# EAGLE design Arduino-Media-Player (EAGLE 6.3)
CNAME: Arduino Media Player; CREVISION: A; DESIGNER: Drawn By: BJE

## Sheet 1 of 3: MIcrocontroller, USB interface, and RTC
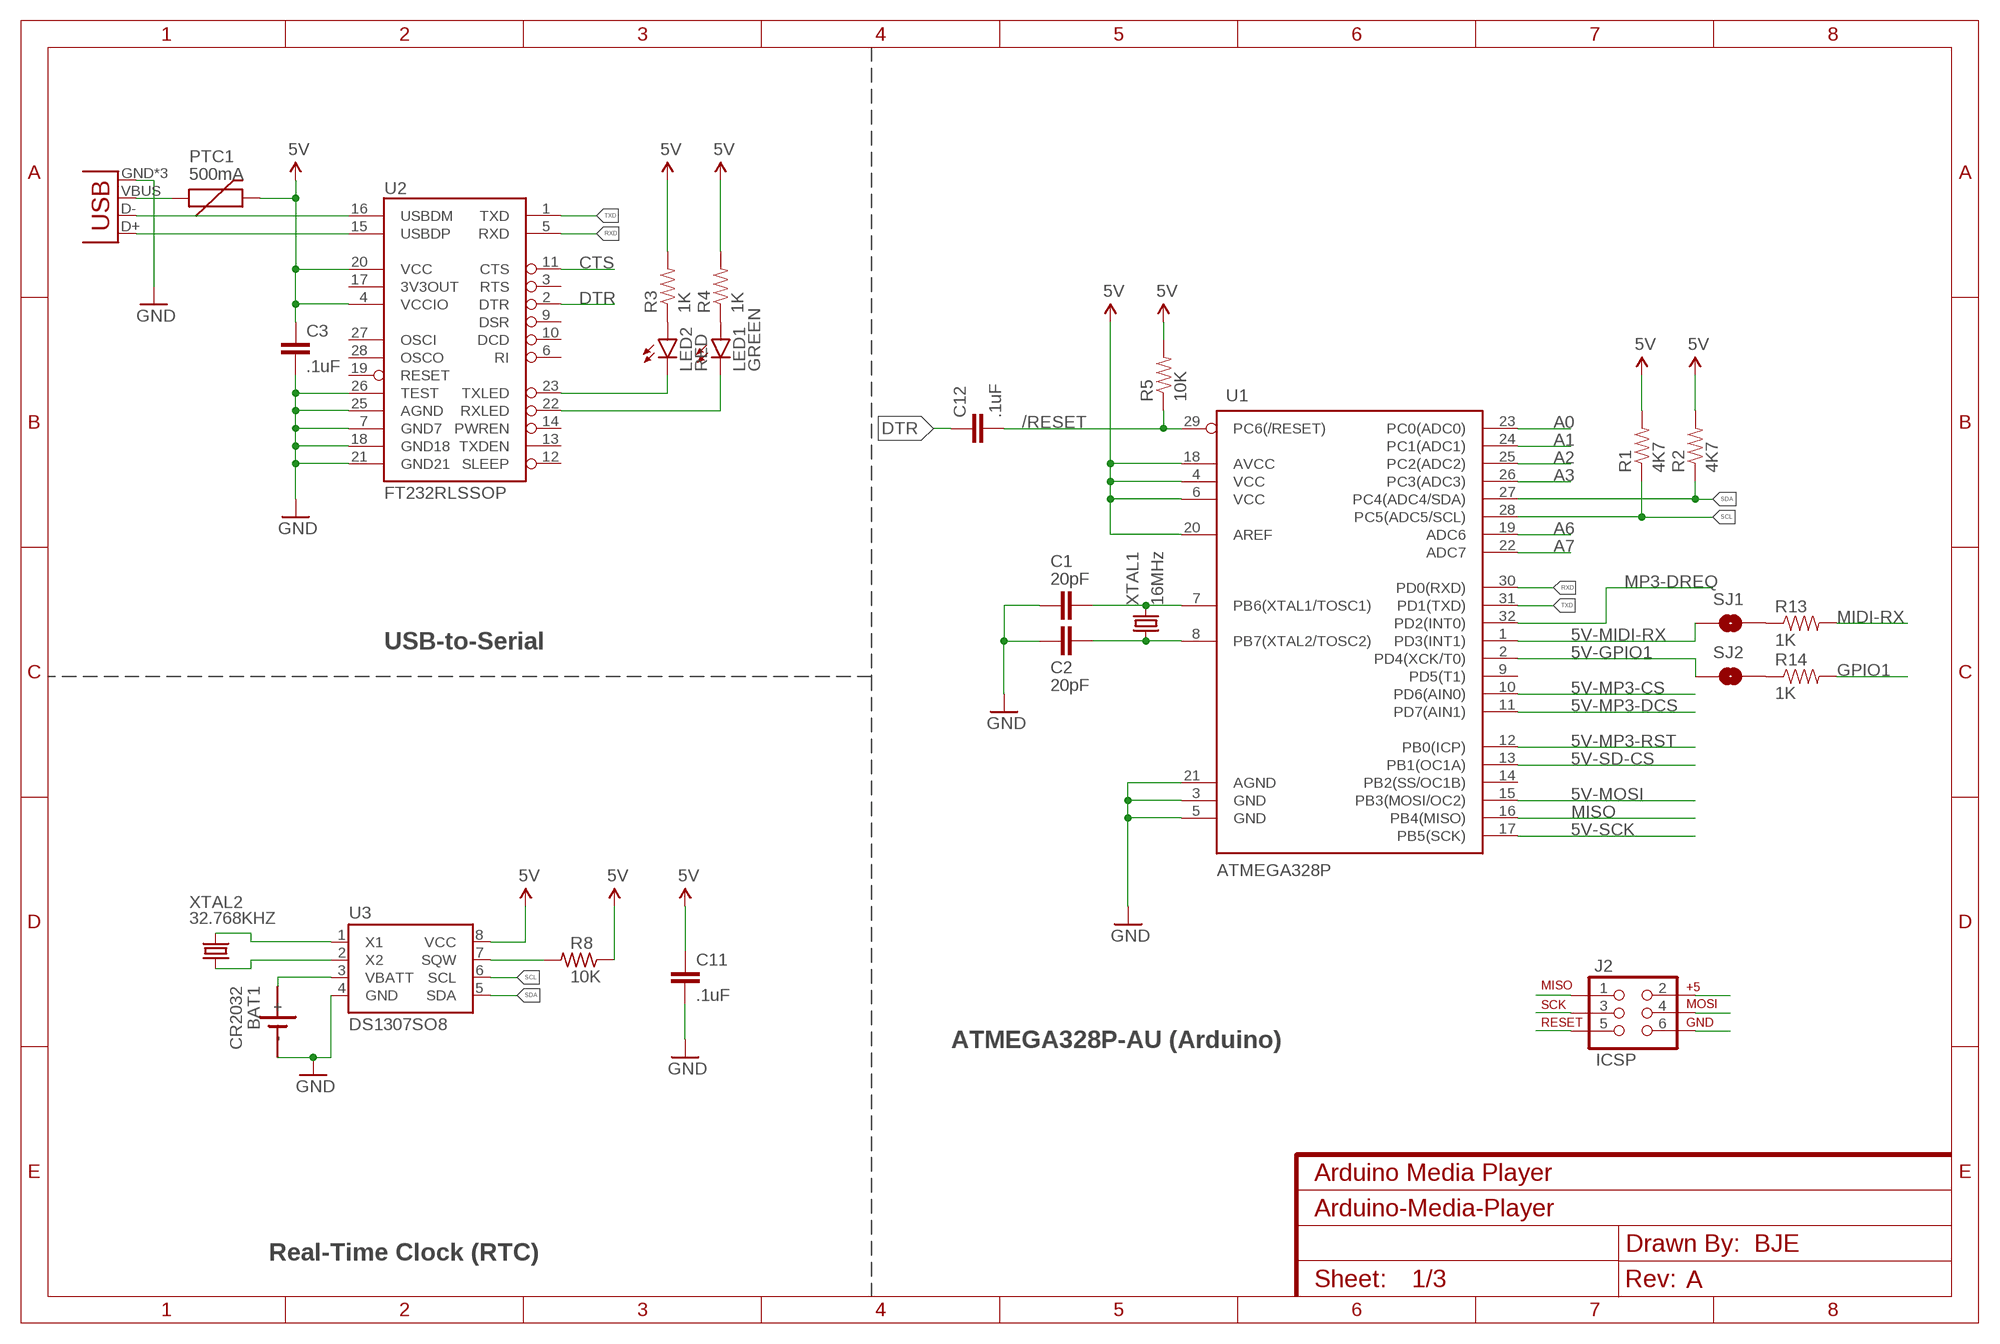
[diagram p0: schematic, sheet 1]

### Parts
BAT1  CR2032  SN2032  [SN2032]
C1  20pF  CAP1206  [1206]
C2  20pF  CAP1206  [1206]
C3  .1uF  CAP0805  [0805]
C11  .1uF  CAP0805  [0805]
C12  .1uF  CAP0805  [0805]
J2  ICSP  AVR_SPI_PRG_6PTH  [2X3]
LED1  GREEN  LED-GREEN0603  [LED-0603]
LED2  RED  LED-RED0603  [LED-0603]
PTC1  500mA  PTC  [0805]
R1  4K7  RESISTOR0805-RES  [0805]
R2  4K7  RESISTOR0805-RES  [0805]
R3  1K  RESISTOR0805-RES  [0805]
R4  1K  RESISTOR0805-RES  [0805]
R5  10K  RESISTOR0805-RES  [0805]
R8  10K  R-US_R0805W  [R0805W]
R13  1K  RESISTOR0805-RES  [0805]
R14  1K  RESISTOR0805-RES  [0805]
SJ1  JUMPER-PAD-2-NOROUND  [PAD-JUMPER-2-NO_YES_SILK_ROUND]
SJ2  JUMPER-PAD-2-NOROUND  [PAD-JUMPER-2-NO_YES_SILK_ROUND]
U1  ATMEGA328P  ATMEGA328_SMT  [TQFP32-08]
U2  FT232RLSSOP  [SSOP28DB]
U3  DS1307SO8  [SO08]
USB1  USB-MICROB  [USB-MICROB]
XTAL1  16MHz  CRYSTAL10.5X4.8  [CRYSTAL-SMD-10.5X4.8-2PIN]
XTAL2  32.768KHZ  CRYSTAL32-SMD  [CRYSTAL-32KHZ-SMD]

### Nets
5V: C3.1 C11.1 J2.2 PTC1.2 R1.2 R2.2 R3.2 R4.2 R5.2 R8.1 U1.4(VCC) U1.6(VCC) U1.18(AVCC) U1.20(AREF) U2.4(VCCIO) U2.20(VCC) U3.8(VCC) ; also sheet 2
5V-GPIO1: SJ2.1 U1.2(PD4(XCK/T0))
5V-MIDI-RX: SJ1.1 U1.1(PD3(INT1))
5V-MOSI: J2.4 U1.15(PB3(MOSI/OC2)) ; also sheet 3
5V-MP3-CS: U1.10(PD6(AIN0)) ; also sheet 3
5V-MP3-DCS: U1.11(PD7(AIN1)) ; also sheet 3
5V-MP3-RST: U1.12(PB0(ICP)) ; also sheet 3
5V-SCK: J2.3 U1.17(PB5(SCK)) ; also sheet 3
5V-SD-CS: U1.13(PB1(OC1A)) ; also sheet 3
/RESET: C12.2 J2.5 R5.1 U1.29(PC6(/RESET))
A0: U1.23(PC0(ADC0))
A1: U1.24(PC1(ADC1))
A2: U1.25(PC2(ADC2))
A3: U1.26(PC3(ADC3))
A6: U1.19(ADC6)
A7: U1.22(ADC7)
CTS: U2.11(CTS)
DS1307X1: U3.1(X1) XTAL2.X2
DS1307X2: U3.2(X2) XTAL2.X1
DTR: C12.1 U2.2(DTR)
GND: BAT1.- C1.1 C2.1 C3.2 C11.2 J2.6 U1.3(GND) U1.5(GND) U1.21(AGND) U2.7(GND7) U2.18(GND18) U2.21(GND21) U2.25(AGND) U2.26(TEST) U3.4(GND) USB1.GND USB1.MT1(GND) USB1.MT2(GND) ; also sheet 2,3
GPIO1: R14.2 ; also sheet 3
MIDI-RX: R13.2 ; also sheet 3
MISO: J2.1 U1.16(PB4(MISO)) ; also sheet 3
MP3-DREQ: U1.32(PD2(INT0)) ; also sheet 3
N$1: R13.1 SJ1.2
N$2: R14.1 SJ2.2
N$4: C1.2 U1.7(PB6(XTAL1/TOSC1)) XTAL1.P$2
N$5: C2.2 U1.8(PB7(XTAL2/TOSC2)) XTAL1.P$1
N$6: LED2.A R3.1
N$7: LED1.A R4.1
N$8: LED2.C U2.23(TXLED)
N$9: LED1.C U2.22(RXLED)
N$10: U2.16(USBDM) USB1.D-
N$11: U2.15(USBDP) USB1.D+
RXD: U1.30(PD0(RXD)) U2.5(RXD)
SCL: R1.1 U1.28(PC5(ADC5/SCL)) U3.6(SCL)
SDA: R2.1 U1.27(PC4(ADC4/SDA)) U3.5(SDA)
SQW: R8.2 U3.7(SQW)
TXD: U1.31(PD1(TXD)) U2.1(TXD)
VBATT: BAT1.+ U3.3(VBATT)
VBUS: PTC1.1 USB1.VBUS
Unconnected: U1.9(PD5(T1)) U1.14(PB2(SS/OC1B)) U2.3(RTS) U2.6(RI) U2.9(DSR) U2.10(DCD) U2.12(SLEEP) U2.13(TXDEN) U2.14(PWREN) U2.17(3V3OUT) U2.19(RESET) U2.27(OSCI) U2.28(OSCO)

### Notes on the sheet
- USB-to-Serial
- ATMEGA328P-AU (Arduino)
- Real-Time Clock (RTC)

## Sheet 2 of 3: Power Supply: Includes 3.3v LDO Regulator 1.8v LDO Regulator Filter capacitors near regulators Notes: Filter caps near other parts are on those parts' respective sheets.
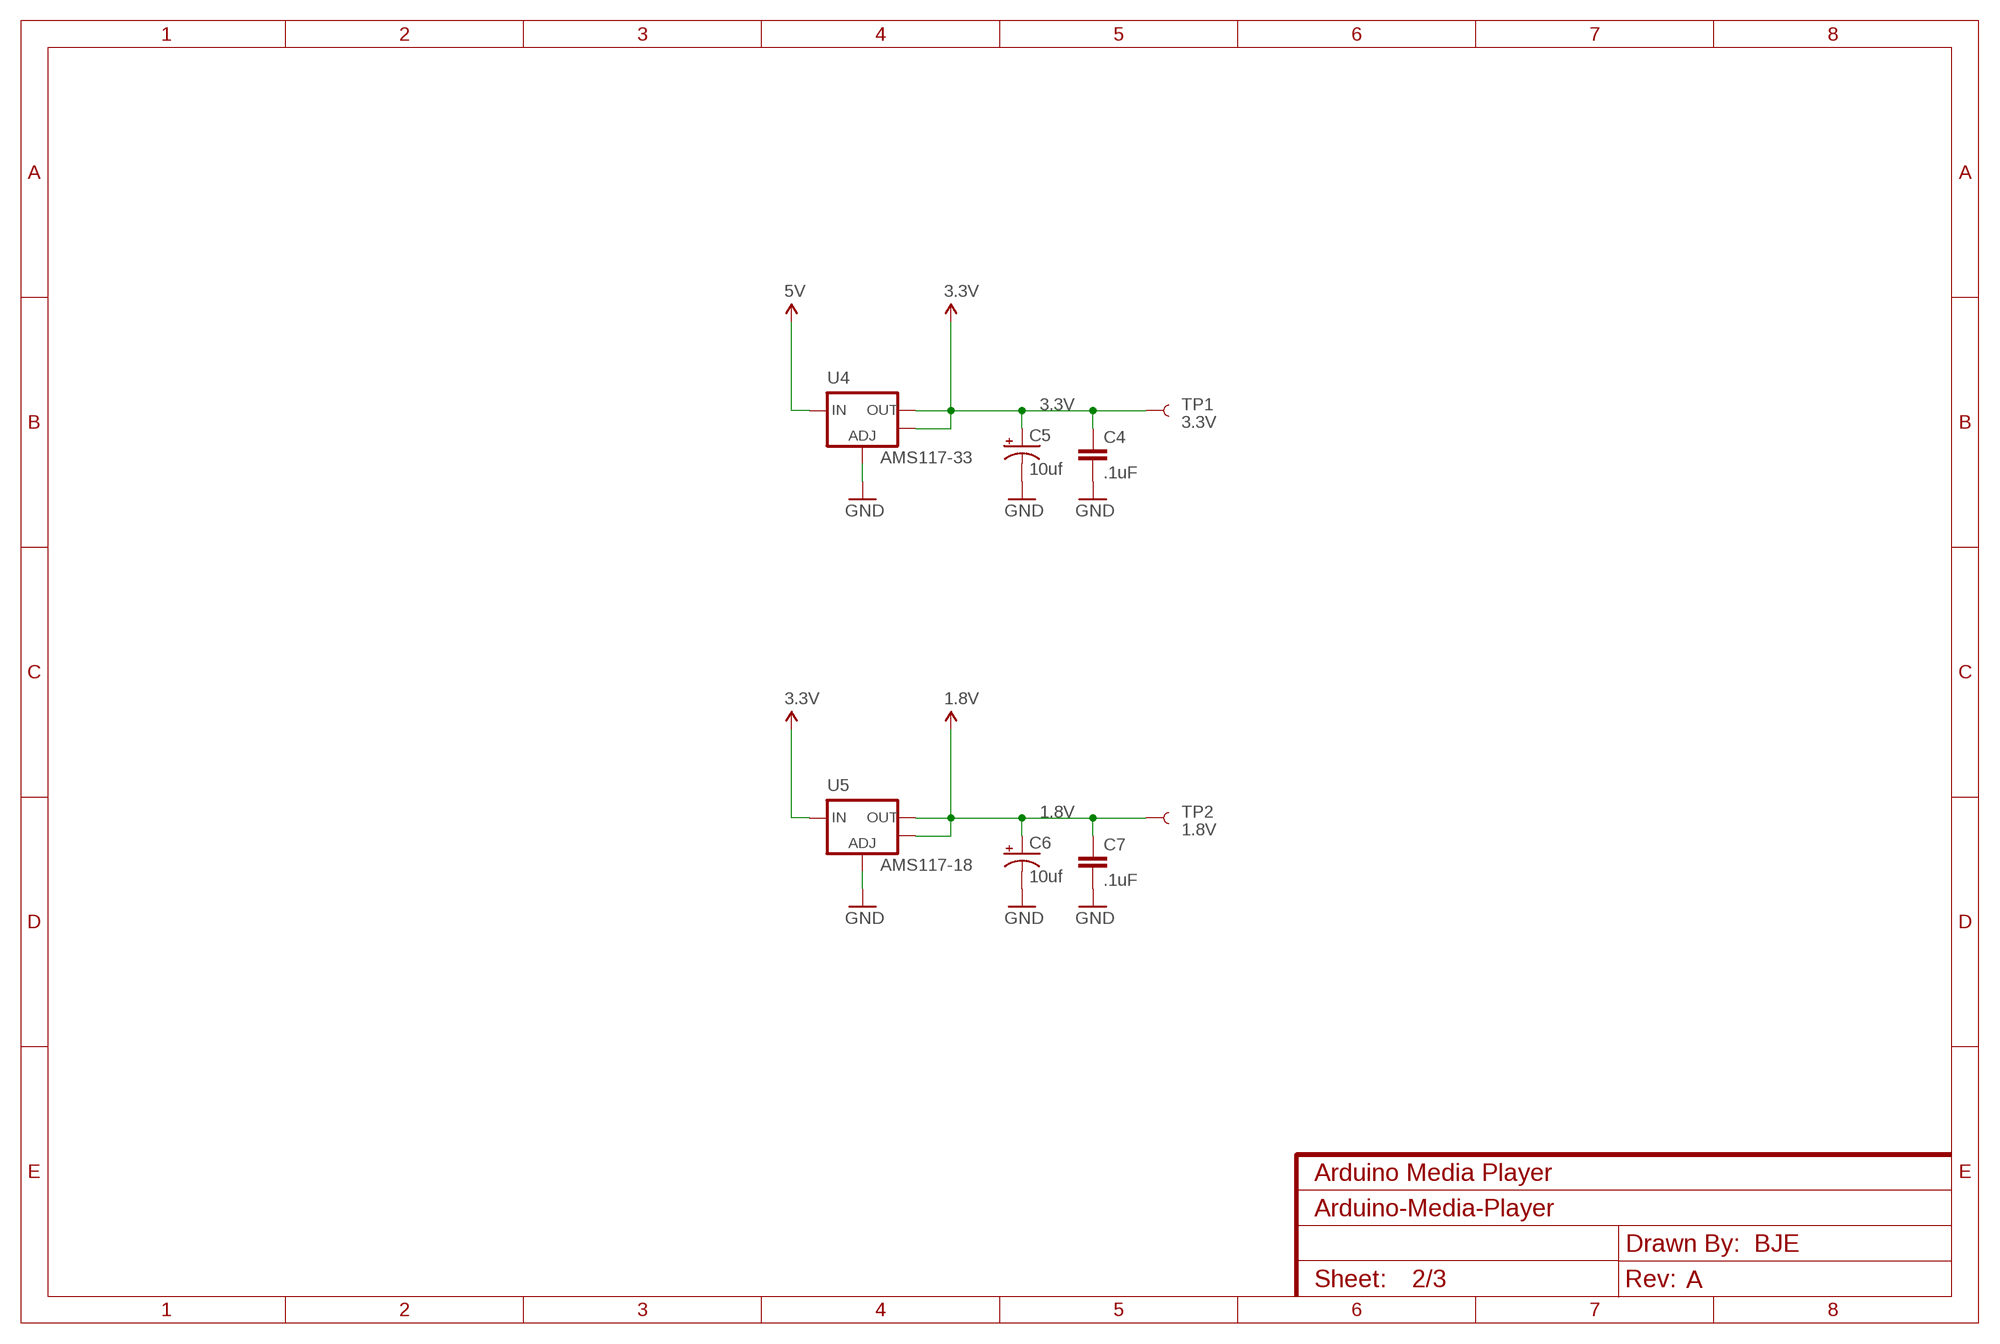
[diagram p1: schematic, sheet 2]

### Parts
C4  .1uF  CAP0805  [0805]
C5  10uf  CAP_POLC  [PANASONIC_C]
C6  10uf  CAP_POLC  [PANASONIC_C]
C7  .1uF  CAP0805  [0805]
TP1  3.3V  TEST-POINT3X4  [PAD.03X.04]
TP2  1.8V  TEST-POINT3X4  [PAD.03X.04]
U4  AMS117-33  V_REG_LM1117SOT223  [SOT223]
U5  AMS117-18  V_REG_LM1117SOT223  [SOT223]

### Nets
1.8V: C6.+ C7.1 TP2.P$1 U5.2(OUT) U5.4(OUT) ; also sheet 3
3.3V: C4.1 C5.+ TP1.P$1 U4.2(OUT) U4.4(OUT) U5.3(IN) ; also sheet 3
5V: U4.3(IN) ; also sheet 1
GND: C4.2 C5.- C6.- C7.2 U4.1(ADJ) U5.1(ADJ) ; also sheet 1,3

## Sheet 3 of 3: MP3 Decoder and supporting circuitry
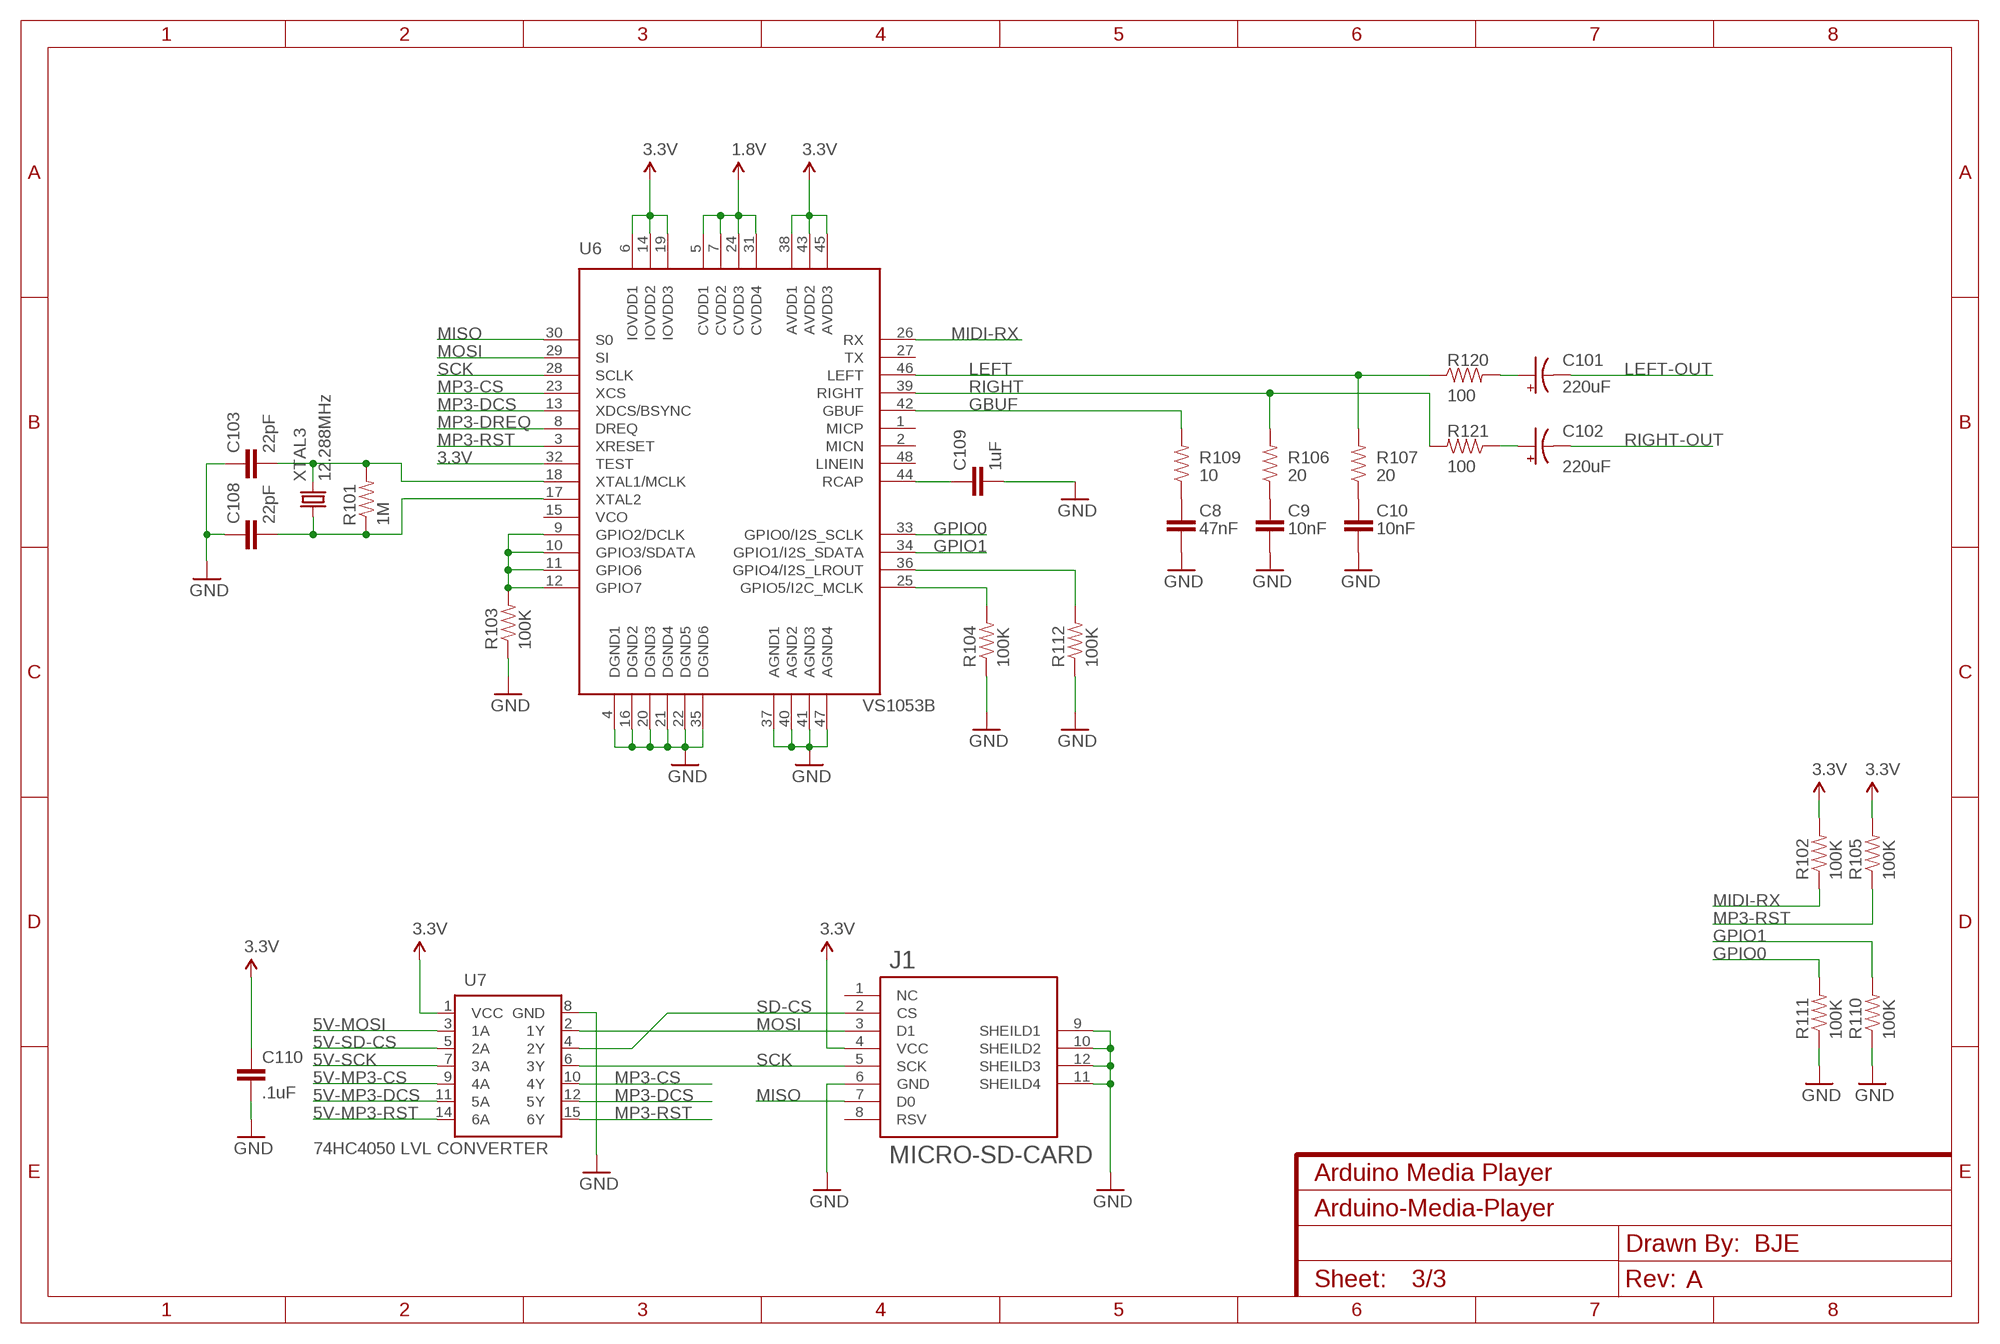
[diagram p2: schematic, sheet 3]

### Parts
C8  47nF  CAP0805  [0805]
C9  10nF  CAP0805  [0805]
C10  10nF  CAP0805  [0805]
C101  220uF  CAP_POLG  [PANASONIC_G]
C102  220uF  CAP_POLG  [PANASONIC_G]
C103  22pF  CAP0805  [0805]
C108  22pF  CAP0805  [0805]
C109  1uF  CAP0805  [0805]
C110  .1uF  CAP0805  [0805]
J1  MICRO-SD-CARD  MICRO-SD-CARD-EBAY  [MICRO-SD-EBAY]
R101  1M  RESISTOR0805-RES  [0805]
R102  100K  RESISTOR0805-RES  [0805]
R103  100K  RESISTOR0805-RES  [0805]
R104  100K  RESISTOR0805-RES  [0805]
R105  100K  RESISTOR0805-RES  [0805]
R106  20  RESISTOR0805-RES  [0805]
R107  20  RESISTOR0805-RES  [0805]
R109  10  RESISTOR0805-RES  [0805]
R110  100K  RESISTOR0805-RES  [0805]
R111  100K  RESISTOR0805-RES  [0805]
R112  100K  RESISTOR0805-RES  [0805]
R120  100  RESISTOR0805-RES  [0805]
R121  100  RESISTOR0805-RES  [0805]
U6  VS1053B  VS1033/1053SMD  [LQFP-48]
U7  74HC4050 LVL CONVERTER  HEX_CONVERTER  [SO016]
XTAL3  12.288MHz  CRYSTAL10.5X4.8  [CRYSTAL-SMD-10.5X4.8-2PIN]

### Nets
1.8V: U6.5(CVDD1) U6.7(CVDD2) U6.24(CVDD3) U6.31(CVDD4) ; also sheet 2
3.3V: C110.1 J1.4(VCC) R102.2 R105.2 U6.6(IOVDD1) U6.14(IOVDD2) U6.19(IOVDD3) U6.32(TEST) U6.38(AVDD1) U6.43(AVDD2) U6.45(AVDD3) U7.1(VCC) ; also sheet 2
5V-MOSI: U7.3(1A) ; also sheet 1
5V-MP3-CS: U7.9(4A) ; also sheet 1
5V-MP3-DCS: U7.11(5A) ; also sheet 1
5V-MP3-RST: U7.14(6A) ; also sheet 1
5V-SCK: U7.7(3A) ; also sheet 1
5V-SD-CS: U7.5(2A) ; also sheet 1
GBUF: R109.2 U6.42(GBUF)
GND: C8.1 C9.1 C10.1 C103.1 C108.1 C109.2 C110.2 J1.6(GND) J1.9(SHEILD1) J1.10(SHEILD2) J1.11(SHEILD4) J1.12(SHEILD3) R103.1 R104.1 R110.1 R111.1 R112.1 U6.4(DGND1) U6.16(DGND2) U6.20(DGND3) U6.21(DGND4) U6.22(DGND5) U6.35(DGND6) U6.37(AGND1) U6.40(AGND2) U6.41(AGND3) U6.47(AGND4) U7.8(GND) ; also sheet 1,2
GPIO0: R111.2 U6.33(GPIO0/I2S_SCLK)
GPIO1: R110.2 U6.34(GPIO1/I2S_SDATA) ; also sheet 1
LEFT: R107.2 R120.1 U6.46(LEFT)
LEFT-OUT: C101.-
MIDI-RX: R102.1 U6.26(RX) ; also sheet 1
MISO: J1.7(D0) U6.30(S0) ; also sheet 1
MOSI: J1.3(D1) U6.29(SI) U7.2(1Y)
MP3-CS: U6.23(XCS) U7.10(4Y)
MP3-DCS: U6.13(XDCS/BSYNC) U7.12(5Y)
MP3-DREQ: U6.8(DREQ) ; also sheet 1
MP3-RST: R105.1 U6.3(XRESET) U7.15(6Y)
N$3: C101.+ R120.2
N$12: R104.2 U6.25(GPIO5/I2C_MCLK)
N$13: R112.2 U6.36(GPIO4/I2S_LROUT)
N$14: C102.+ R121.1
N$15: C8.2 R109.1
N$16: R103.2 U6.9(GPIO2/DCLK) U6.10(GPIO3/SDATA) U6.11(GPIO6) U6.12(GPIO7)
N$17: C9.2 R106.1
N$18: C10.2 R107.1
RCAP: C109.1 U6.44(RCAP)
RIGHT: R106.2 R121.2 U6.39(RIGHT)
RIGHT-OUT: C102.-
SCK: J1.5(SCK) U6.28(SCLK) U7.6(3Y)
SD-CS: J1.2(CS) U7.4(2Y)
VS1053XTAL1: C103.2 R101.2 U6.18(XTAL1/MCLK) XTAL3.P$2
VS1053XTAL2: C108.2 R101.1 U6.17(XTAL2) XTAL3.P$1
Unconnected: J1.1(NC) J1.8(RSV) U6.1(MICP) U6.2(MICN) U6.15(VCO) U6.27(TX) U6.48(LINEIN)

## Library data of the parts
BAT1 = sn2032:SN2032: LI BATTERY
C1 C2 = SparkFun-Capacitors:CAP: Capacitor Standard 0603 ceramic capacitor, and 0.1" leaded capacitor.
C3 C4 C7-C12 C103 C108-C110 = SparkFun-Passives:CAP: Capacitor Standard 0603 ceramic capacitor, and 0.1" leaded capacitor.
C5 C6 C101 C102 = SparkFun-Passives:CAP_POL: Capacitor Polarized These are standard SMD and PTH capacitors. Normally 10uF, 47uF, and 100uF in electrolytic and tantalum varieties. Always verify the external diameter of the through hole cap, it varies with capacity, voltage, and manufacturer. The EIA devices should be standard.
J1 = SparkFun-Connectors-EDITED:MICRO-SD-CARD-EBAY
J2 = SparkFun-Connectors-EDITED:AVR_SPI_PRG_6: AVR ISP 6 Pin This is the reduced ISP connector for AVR programming. Common on Arduino. This footprint will take up less PCB space and can be used with a 10-pin to 6-pin adapter such as SKU: BOB-08508 **Special note about "TEST_POINT" package. The stop mask is on the top side, so if you want your programming test points to be on the bottom of your board, make sure to place this package on the bottom side of the board. This also ensure that the orientation to program from the bottom side will be correct.
LED1 = SparkFun-LED:LED-GREEN: Various green LEDs Green LEDs used in SFE Production 0603- DIO-00821 LARGE- DIO-00862 LILYPAD- DIO-09910; PROD_ID: DIO-00821
LED2 = SparkFun-LED:LED-RED: Assorted Red LEDs LilyPad 1206- DIO-09912 1206- DIO-00809 0603- DIO-00819; PROD_ID: DIO-00819
PTC1 = SparkFun-Passives:PTC: Resettable Fuse PTC Resettable Fuse. Spark Fun Electronics SKU : COM-08357
R1-R5 R13 R14 R101-R107 R109-R112 R120 R121 = SparkFun-Passives:RESISTOR: Resistor Basic schematic elements and footprints for 0603, 1206, and PTH resistors.
R8 = rcl:R-US_: RESISTOR, American symbol
SJ1 SJ2 = SparkFun-Passives:JUMPER-PAD-2-NO
TP1 TP2 = SparkFun-Passives:TEST-POINT: Bare copper test points for troubleshooting or ICT
U1 = SparkFun-DigitalIC:ATMEGA328_SMT: 32-Pin Atmega328 part Commonly used on Arduino compatible boards Available in QFP and QFN packages TQFP is IC-09069 QFN is non-stock; PROD_ID: IC-09069
U2 = SparkFun-DigitalIC:FT232RL: USB UART FT232RL 4th Generation USB UART (USB <-> Serial) Controller. Spark Fun Electronics SKU : COM-00650 Production SKU IC-00870; PROD_ID: IC-00870
U3 = SparkFun-FreqCtrl:DS1307: I2C real-time clock with battery backup.
U4 U5 = SparkFun-PowerIC:V_REG_LM1117: Voltage Regulator LM1117 Standard adjustable voltage regulator but in SMD form. Spark Fun Electronics SKU : COM-00595
U6 = SparkFun-DigitalIC:VS1033/1053: MP3 codec; PROD_ID: IC-08983
U7 = SparkFun-DigitalIC:HEX_CONVERTER: Just what it says.
USB1 = SparkFun-Connectors:USB: USB Connectors USB-B-PTH is fully proven SKU : PRT-00139/CONN-08278 USB-miniB is fully proven SKU : PRT-00587 USB-A-PCB is untested. USB-A-H is throughly reviewed, but untested. Spark Fun Electronics SKU : PRT-00437 USB-B-SMT is throughly reviewed, but untested. Needs silkscreen touching up. USB-A-S has not been used/tested USB-MB-H has not been used/tested USB-MICROB has been used. CONN-09505; PROD_ID: CONN-09505
XTAL1 XTAL3 = SparkFun-FreqCtrl:CRYSTAL: Various standard crystals. Proven footprints. Spark Fun Electronics SKU : COM-00534
XTAL2 = SparkFun-FreqCtrl:CRYSTAL: Various standard crystals. Proven footprints. Spark Fun Electronics SKU : COM-00534; PROD_ID: XTAL-07894

## Board
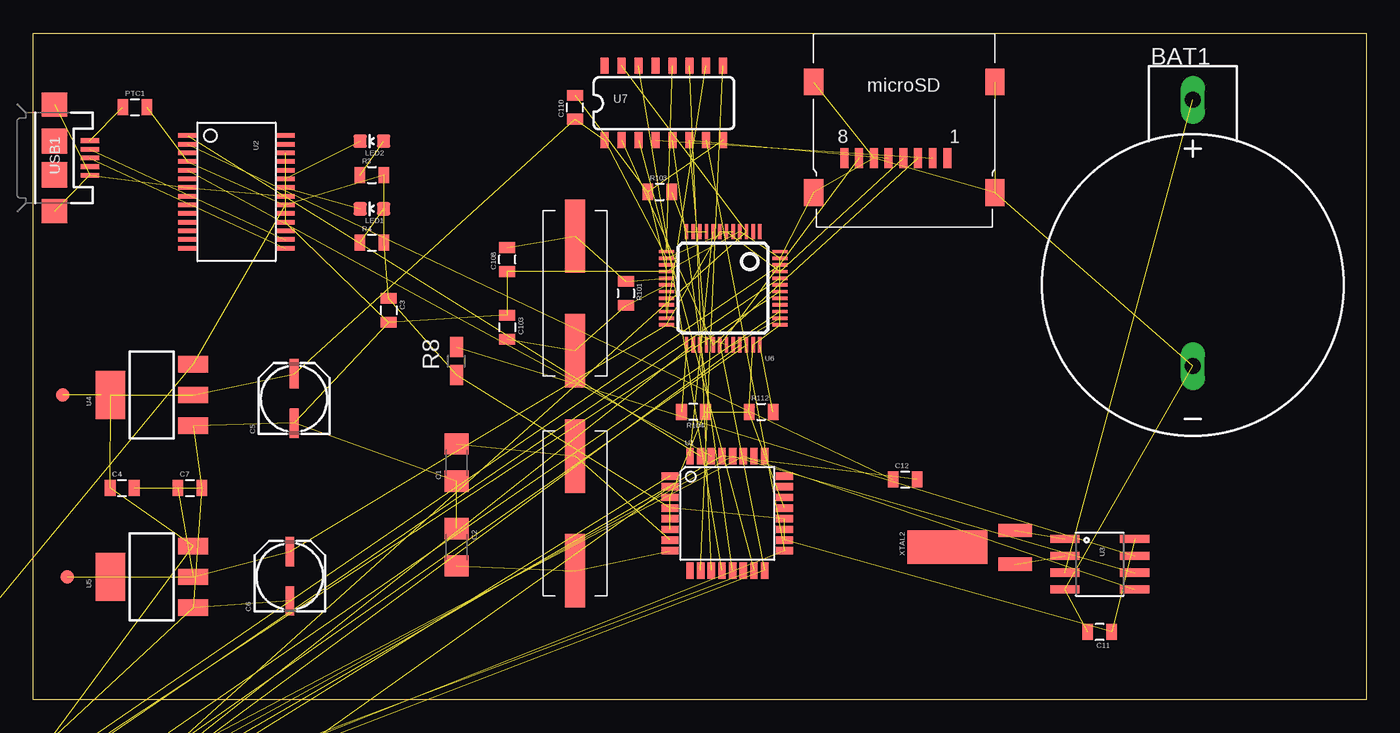
[diagram p3: board, top side]

Size 100 x 50 mm. Coordinates in mm from the lower left corner, seen from the top.
Outline: 0,0 0,50 100,50 100,0 0,0
Copper layers (1*16): Top 0.035mm / dielectric 1.5mm / Bottom 0.035mm
Design rules "default": minimum track width 10mil, minimum drill 24mil, track to track 8mil, track to pad 8mil, pad to pad 8mil, via to via 8mil, smd to smd 8mil, copper to edge 40mil, drill to drill 8mil, minimum pad ring 10mil, minimum via ring 8mil, stop-mask expansion 4mil, vias tented up to drill 0mil, thermal gap 10mil

### Footprints (pad centres in the part's own frame; a part is rotated, then mirrored left to right if it is on the bottom)
SN2032 = drill 1.2 long: + 0,13.9; - 0,-6.1
1206 = smd 1.6 x 1.8: 1 -1.4,0; 2 1.4,0
0805 = smd 0.8 x 1.2: 1 -0.9,0; 2 0.9,0
PANASONIC_C = smd 2.2 x 0.65: + 1.9,-0.2; - -1.8,-0.2
PANASONIC_G = smd 3.9 x 1.6: + 4.25,0; - -4.25,0
MICRO-SD-EBAY = smd 0.6 x 1.5: 1 0,0; 2 -1.105,0; 3 -2.21,0; 4 -3.315,0; 5 -4.42,0; 6 -5.525,0; 7 -6.63,0; 8 -7.735,0 | smd 1.45 x 2: 9 -10.035,5.7; 10 3.565,5.7; 11 -10.035,-2.6; 12 3.565,-2.6
2X3 = drill 1.016 pad 1.88 octagon: 1 0,0; 2 0,2.54; 3 2.54,0; 4 2.54,2.54; 5 5.08,0; 6 5.08,2.54
LED-0603 = smd 1 x 1: A 0,-0.877; C 0,0.877
R0805W = smd 1.5 x 1: 1 -1.052,0; 2 1.052,0
PAD-JUMPER-2-NO_YES_SILK_ROUND = smd 0.152 x 0.305: 1 -1.27,0; 2 1.27,0
PAD.03X.04 = smd 1.016 x 1.016: P$1 0,0
TQFP32-08 = smd 1.27 x 0.559: 1 -4.293,2.8; 2 -4.293,2; 3 -4.293,1.2; 4 -4.293,0.4; 5 -4.293,-0.4; 6 -4.293,-1.2; 7 -4.293,-2; 8 -4.293,-2.8; 17 4.293,-2.8; 18 4.293,-2; 19 4.293,-1.2; 20 4.293,-0.4; 21 4.293,0.4; 22 4.293,1.2; 23 4.293,2; 24 4.293,2.8 | smd 0.559 x 1.27: 9 -2.8,-4.293; 10 -2,-4.293; 11 -1.2,-4.293; 12 -0.4,-4.293; 13 0.4,-4.293; 14 1.2,-4.293; 15 2,-4.293; 16 2.8,-4.293; 25 2.8,4.293; 26 2,4.293; 27 1.2,4.293; 28 0.4,4.293; 29 -0.4,4.293; 30 -1.2,4.293; 31 -2,4.293; 32 -2.8,4.293
SSOP28DB = smd 0.348 x 1.397: 1 -4.225,-3.656; 2 -3.575,-3.656; 3 -2.925,-3.656; 4 -2.275,-3.656; 5 -1.625,-3.656; 6 -0.975,-3.656; 7 -0.325,-3.656; 8 0.325,-3.656; 9 0.975,-3.656; 10 1.625,-3.656; 11 2.275,-3.656; 12 2.925,-3.656; 13 3.575,-3.656; 14 4.225,-3.656; 15 4.225,3.656; 16 3.575,3.656; 17 2.925,3.656; 18 2.275,3.656; 19 1.625,3.656; 20 0.975,3.656; 21 0.325,3.656; 22 -0.325,3.656; 23 -0.975,3.656; 24 -1.625,3.656; 25 -2.275,3.656; 26 -2.925,3.656; 27 -3.575,3.656; 28 -4.225,3.656
SO08 = smd 0.61 x 2.21: 1 -1.905,-2.616; 2 -0.635,-2.616; 3 0.635,-2.616; 4 1.905,-2.616; 5 1.905,2.616; 6 0.635,2.616; 7 -0.635,2.616; 8 -1.905,2.616
SOT223 = smd 1.219 x 2.235: 1 -2.311,-3.099; 2 0,-3.099; 3 2.311,-3.099 | smd 3.6 x 2.2: 4 0,3.099
LQFP-48 = smd 0.254 x 1.143: 1 -2.75,-4.25; 2 -2.25,-4.25; 3 -1.75,-4.25; 4 -1.25,-4.25; 5 -0.75,-4.25; 6 -0.25,-4.25; 7 0.25,-4.25; 8 0.75,-4.25; 9 1.25,-4.25; 10 1.75,-4.25; 11 2.25,-4.25; 12 2.75,-4.25; 25 2.75,4.25; 26 2.25,4.25; 27 1.75,4.25; 28 1.25,4.25; 29 0.75,4.25; 30 0.25,4.25; 31 -0.25,4.25; 32 -0.75,4.25; 33 -1.25,4.25; 34 -1.75,4.25; 35 -2.25,4.25; 36 -2.75,4.25 | smd 1.143 x 0.254: 13 4.25,-2.75; 14 4.25,-2.25; 15 4.25,-1.75; 16 4.25,-1.25; 17 4.25,-0.75; 18 4.25,-0.25; 19 4.25,0.25; 20 4.25,0.75; 21 4.25,1.25; 22 4.25,1.75; 23 4.25,2.25; 24 4.25,2.75; 37 -4.25,2.75; 38 -4.25,2.25; 39 -4.25,1.75; 40 -4.25,1.25; 41 -4.25,0.75; 42 -4.25,0.25; 43 -4.25,-0.25; 44 -4.25,-0.75; 45 -4.25,-1.25; 46 -4.25,-1.75; 47 -4.25,-2.25; 48 -4.25,-2.75
SO016 = smd 0.6 x 1.2: 1 -4.445,-2.8; 2 -3.175,-2.8; 3 -1.905,-2.8; 4 -0.635,-2.8; 5 0.635,-2.8; 6 1.905,-2.8; 7 3.175,-2.8; 8 4.445,-2.8; 9 4.445,2.8; 10 3.175,2.8; 11 1.905,2.8; 12 0.635,2.8; 13 -0.635,2.8; 14 -1.905,2.8; 15 -3.175,2.8; 16 -4.445,2.8
USB-MICROB = smd 0.35 x 1.4: D+ 0,2.65; D- -0.65,2.65; GND 1.3,2.65; ID 0.65,2.65; VBUS -1.3,2.65 | smd 1.8 x 1.9: MT1 -4,0; MT2 4,0 | smd 1.9 x 1.9: P$1 -1.27,0; P$2 1.27,0
CRYSTAL-SMD-10.5X4.8-2PIN = smd 5.5 x 1.5: P$1 -4.3,0; P$2 4.3,0
CRYSTAL-32KHZ-SMD = smd 2.5 x 6: SHEILD 0,5.08 | smd 1 x 2.5: X1 -1.27,0; X2 1.27,0

### Placement (x,y rotation side)
BAT1  87,31.11 0 top
C1  31.75,17.78 90 top
C2  31.75,11.43 270 top
C3  26.67,29.21 270 top
C4  6.67,15.88 0 top
C5  19.37,22.54 90 top
C6  19.05,9.21 90 top
C7  11.75,15.88 0 top
C8  -68.58,-48.26 0 top  (outside the outline)
C9  -80.01,-48.26 0 top  (outside the outline)
C10  -83.82,-48.26 0 top  (outside the outline)
C11  80.01,5.08 180 top
C12  65.41,16.51 0 top
C101  27.94,-11.43 0 top  (outside the outline)
C102  43.18,-11.43 0 top  (outside the outline)
C103  35.56,27.94 270 top
C108  35.56,33.02 90 top
C109  1uF  [1206]  -18.41,-20 0 top  (outside the outline)
C110  40.64,44.45 90 top
J1  68.58,40.64 0 top
J2  -92.71,-46.99 0 top  (outside the outline)
LED1  25.4,36.83 90 top
LED2  25.4,41.91 90 top
PTC1  7.62,44.45 0 top
R1  -41.91,-34.29 0 top  (outside the outline)
R2  -45.72,-34.29 0 top  (outside the outline)
R3  25.4,39.37 0 top
R4  25.4,34.29 0 top
R5  -38.1,-34.29 0 top  (outside the outline)
R8  31.75,25.4 90 top
R13  -49.53,-48.26 0 top  (outside the outline)
R14  -53.34,-48.26 0 top  (outside the outline)
R101  44.45,30.48 270 top
R102  -26.67,-34.29 0 top  (outside the outline)
R103  46.99,38.1 0 top
R104  49.53,21.59 180 top
R105  -22.86,-34.29 0 top  (outside the outline)
R106  -76.2,-48.26 0 top  (outside the outline)
R107  -72.39,-48.26 0 top  (outside the outline)
R109  -64.77,-48.26 0 top  (outside the outline)
R110  -34.29,-34.29 0 top  (outside the outline)
R111  -30.48,-34.29 0 top  (outside the outline)
R112  54.61,21.59 0 top
R120  -60.96,-48.26 0 top  (outside the outline)
R121  -57.15,-48.26 0 top  (outside the outline)
SJ1  -43.18,-40.64 0 top  (outside the outline)
SJ2  -43.18,-49.53 0 top  (outside the outline)
TP1  2.22,22.86 0 top
TP2  2.54,9.21 0 top
U1  52.07,13.97 0 top
U2  15.24,38.1 270 top
U3  80.01,10.16 270 top
U4  8.89,22.86 90 top
U5  8.89,9.21 90 top
U6  51.76,30.87 180 top
U7  47.31,44.77 0 top
USB1  1.59,40.64 270 top
XTAL1  40.64,13.97 90 top
XTAL2  73.66,11.43 90 top
XTAL3  40.64,30.48 270 top

### Tracks (layer width: path | path; a pad name or v marks a point on that pad's centre or on a via)
1.8V  (8 unrouted)
3.3V  (17 unrouted)
  Top 0.406: U4.4 5.08,22.86
5V  (17 unrouted)
5V-GPIO1  (1 unrouted)
5V-MIDI-RX  (1 unrouted)
5V-MOSI  (2 unrouted)
5V-MP3-CS  (1 unrouted)
5V-MP3-DCS  (1 unrouted)
5V-MP3-RST  (1 unrouted)
5V-SCK  (2 unrouted)
5V-SD-CS  (1 unrouted)
/RESET  (3 unrouted)
DS1307X1  (1 unrouted)
DS1307X2  (1 unrouted)
DTR  (1 unrouted)
GBUF  (1 unrouted)
GND  (51 unrouted)
GPIO0  (1 unrouted)
GPIO1  (2 unrouted)
LEFT  (2 unrouted)
MIDI-RX  (2 unrouted)
MISO  (3 unrouted)
MOSI  (2 unrouted)
MP3-CS  (1 unrouted)
MP3-DCS  (1 unrouted)
MP3-DREQ  (1 unrouted)
MP3-RST  (2 unrouted)
N$1  (1 unrouted)
N$2  (1 unrouted)
N$3  (1 unrouted)
N$4  (2 unrouted)
N$5  (2 unrouted)
N$6  (1 unrouted)
N$7  (1 unrouted)
N$8  (1 unrouted)
N$9  (1 unrouted)
N$10  (1 unrouted)
N$11  (1 unrouted)
N$12  (1 unrouted)
N$13  (1 unrouted)
N$14  (1 unrouted)
N$15  (1 unrouted)
N$16  (4 unrouted)
N$17  (1 unrouted)
N$18  (1 unrouted)
RCAP  (1 unrouted)
RIGHT  (2 unrouted)
RXD  (1 unrouted)
SCK  (2 unrouted)
SCL  (2 unrouted)
SD-CS  (1 unrouted)
SDA  (2 unrouted)
SQW  (1 unrouted)
TXD  (1 unrouted)
VBATT  (1 unrouted)
VBUS  (1 unrouted)
VS1053XTAL1  (3 unrouted)
VS1053XTAL2  (3 unrouted)